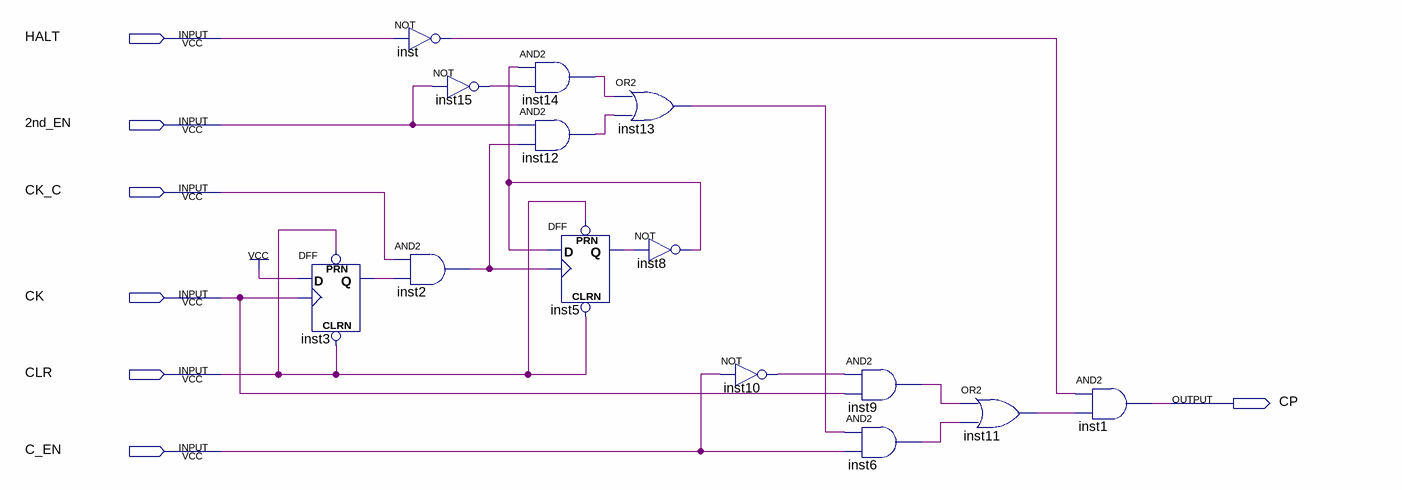
[diagram p0: schematic sheet]
// Quartus schematic start_circuit.bdf as structural Verilog: 14 symbols, 7 pins
module start_circuit (
  input  HALT,
  input  \2nd_EN ,
  input  CK_C,
  input  CK,
  input  CLR,
  input  C_EN,
  output CP
);

  wire inst2_out, inst3_q, inst5_q, inst6_out, inst8_out, inst9_out, inst10_out, inst11_out, inst12_out,
       inst13_out, inst14_out, inst15_out, inst_out;

  DFF inst3 (.CLRN(CLR), .CLK(CK), .D(1'b1), .PRN(CLR), .Q(inst3_q));
  not inst (inst_out, HALT);
  not inst15 (inst15_out, \2nd_EN );
  and inst2 (inst2_out, CK_C, inst3_q);
  and inst14 (inst14_out, inst8_out, inst15_out);
  and inst12 (inst12_out, \2nd_EN , inst2_out);
  DFF inst5 (.CLRN(CLR), .CLK(inst2_out), .D(inst8_out), .PRN(CLR), .Q(inst5_q));
  or inst13 (inst13_out, inst14_out, inst12_out);
  not inst8 (inst8_out, inst5_q);
  not inst10 (inst10_out, C_EN);
  and inst9 (inst9_out, inst10_out, CK);
  and inst6 (inst6_out, inst13_out, C_EN);
  or inst11 (inst11_out, inst9_out, inst6_out);
  and inst1 (CP, inst_out, inst11_out);
endmodule
